# Altium schematic sheet Moto_Driver.SchDoc
size A3
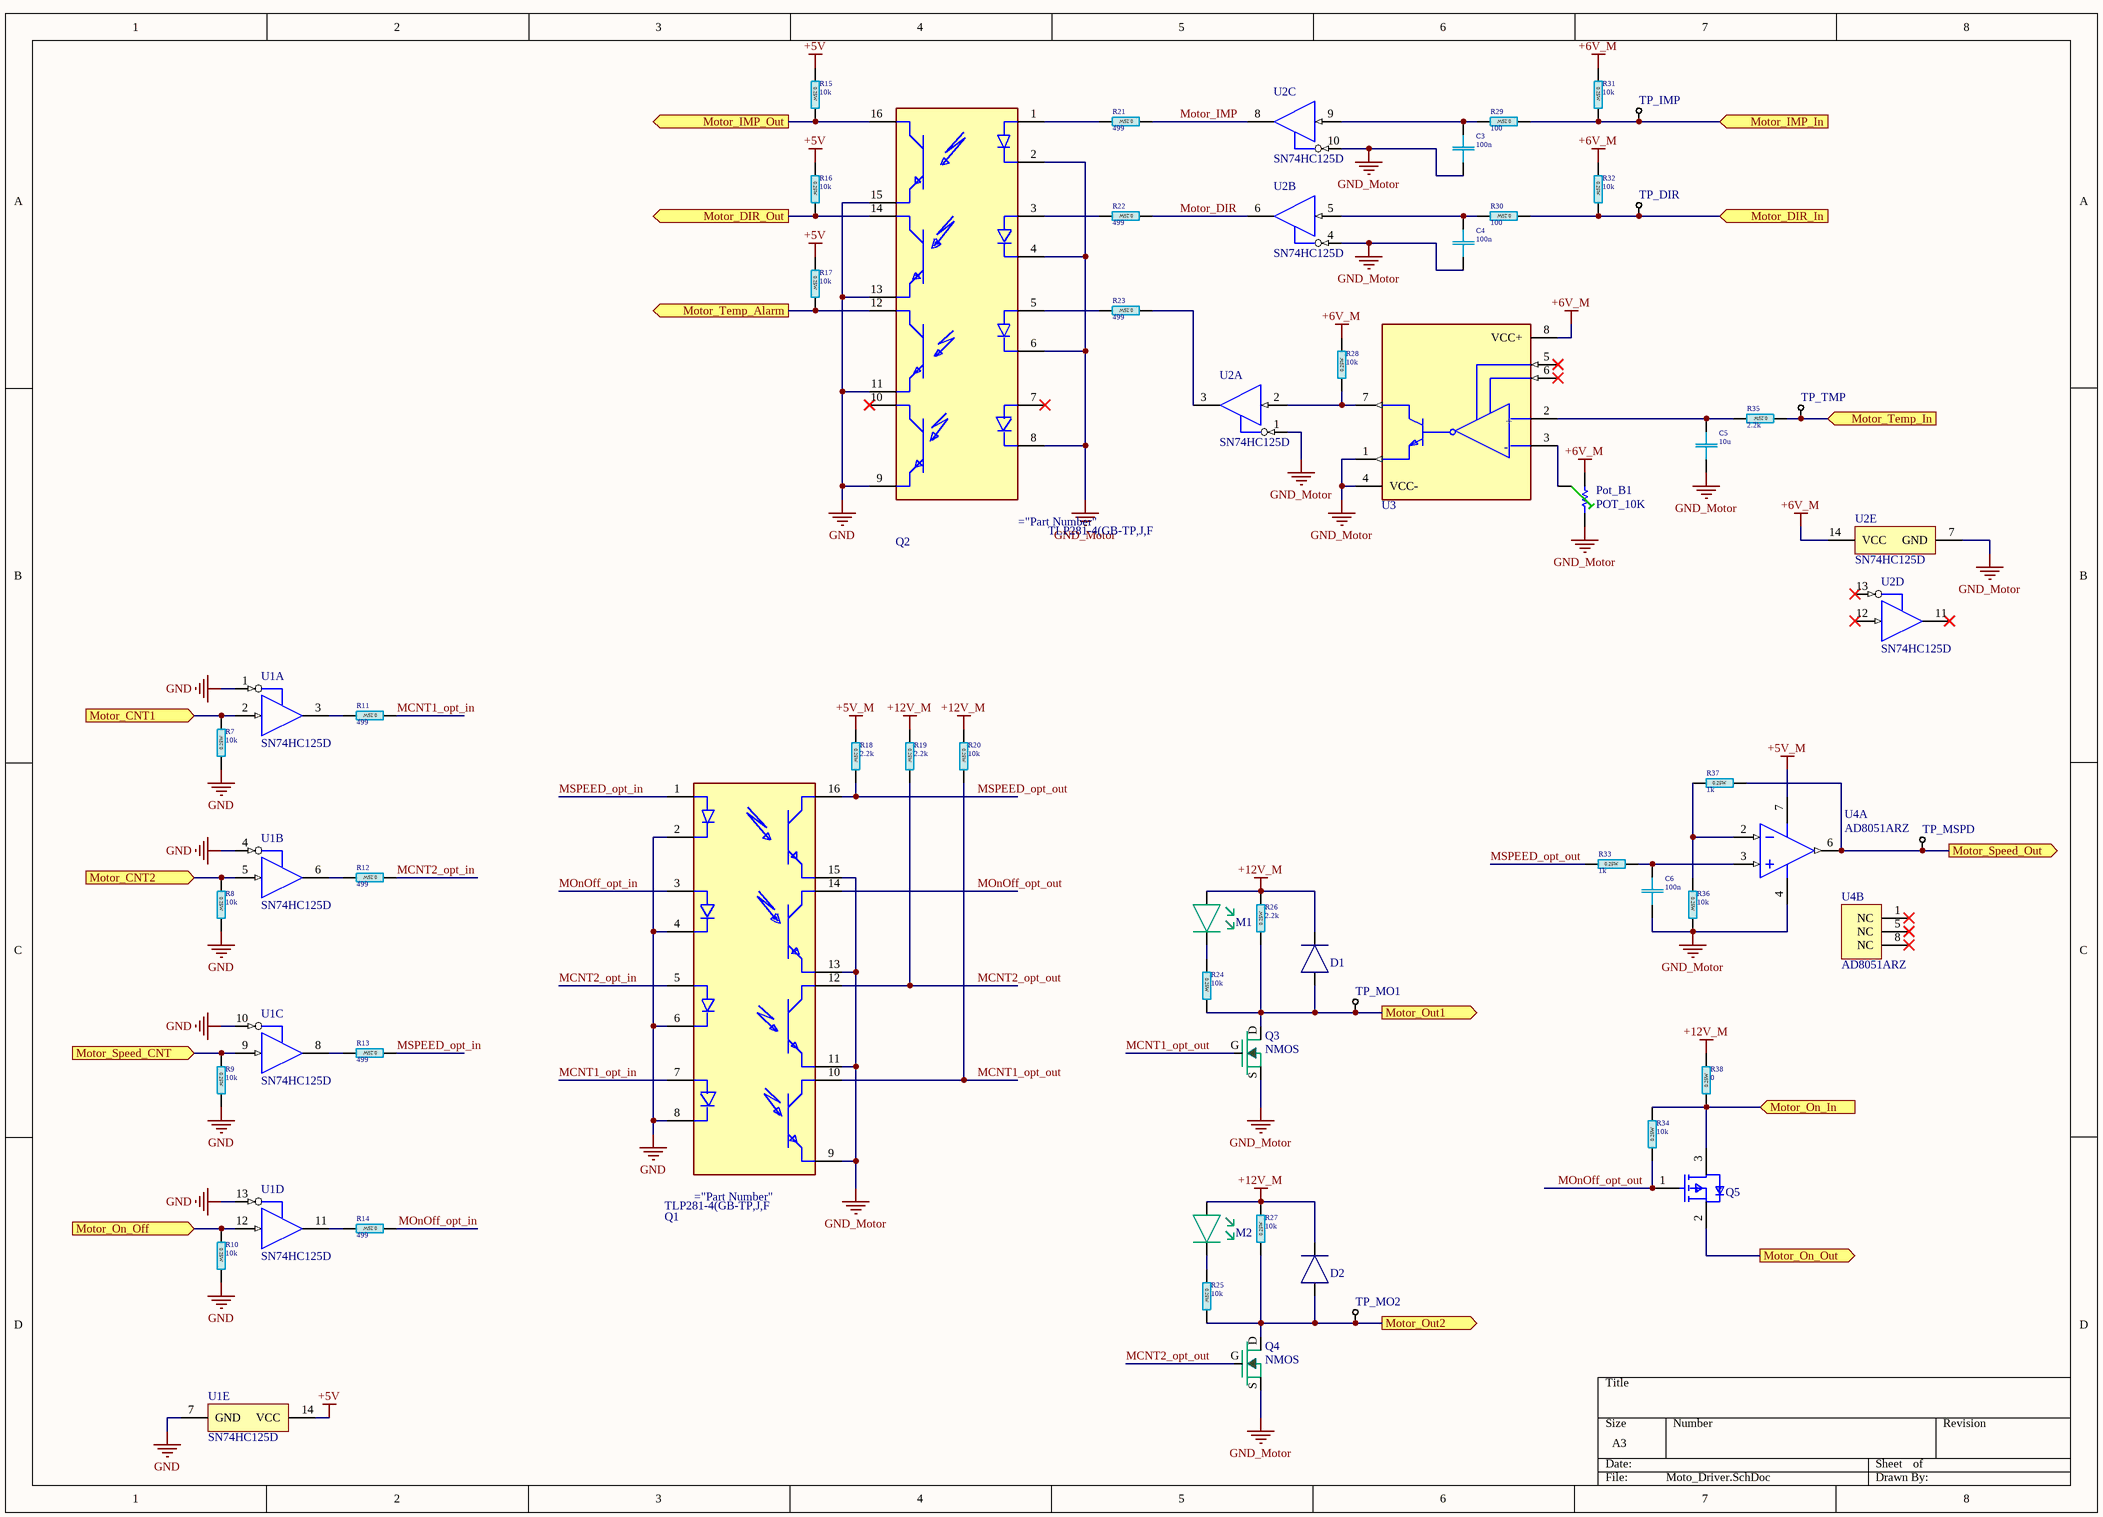
[diagram p0: Moto_Driver.SchDoc]

## Parts
C3  100n  [C1206]
C4  100n  [C1206]
C5  10u  [C1206]
C6  100n  [C1206]
D1  Diode  [Diode-M7]  (value not drawn)
D2  Diode  [Diode-M7]  (value not drawn)
M1  LED  [LED 1206]  (value not drawn)
M2  LED  [LED 1206]  (value not drawn)
Pot_B1  POT_10K  [3296W]
Q1  TLP281-4_GB-TP,J,F  [Toshiba_11-10F1_0]  (value not drawn)
Q2  TLP281-4_GB-TP,J,F  [Toshiba_11-10F1_0]  (value not drawn)
Q3  NMOS  [NMOS SOT-23]
Q4  NMOS  [NMOS SOT-23]
Q5  FDN360P  [ON_Semiconductor_527AG-01_IPC_A]  (value not drawn)
R7  10k  [R1206]
R8  10k  [R1206]
R9  10k  [R1206]
R10  10k  [R1206]
R11  499  [R1206]
R12  499  [R1206]
R13  499  [R1206]
R14  499  [R1206]
R15  10k  [R1206]
R16  10k  [R1206]
R17  10k  [R1206]
R18  2.2k  [R1206]
R19  2.2k  [R1206]
R20  10k  [R1206]
R21  499  [R1206]
R22  499  [R1206]
R23  499  [R1206]
R24  10k  [R1206]
R25  10k  [R1206]
R26  2.2k  [R1206]
R27  10k  [R1206]
R28  10k  [R1206]
R29  100  [R1206]
R30  100  [R1206]
R31  10k  [R1206]
R32  10k  [R1206]
R33  1k  [R1206]
R34  10k  [R1206]
R35  2.2k  [R1206]
R36  10k  [R1206]
R37  1k  [R1206]
R38  0  [R1206]
TP_DIR  Test Point  [Test Point Small]  (value not drawn)
TP_IMP  Test Point  [Test Point Small]  (value not drawn)
TP_MO1  Test Point  [Test Point Small]  (value not drawn)
TP_MO2  Test Point  [Test Point Small]  (value not drawn)
TP_MSPD  Test Point  [Test Point Small]  (value not drawn)
TP_TMP  Test Point  [Test Point Small]  (value not drawn)
U1  SN74HC125D  [D0014A_M]  (parts A,B,C,D,E of 5)
U2  SN74HC125D  [D0014A_M]  (parts A,B,C,D,E of 5)
U3  LM311D  [Texas_Instruments_D_R-PDSO-G8_0]  (value not drawn)
U4  AD8051ARZ  [ADI-R-8_M]  (parts A,B of 2)

## Ports
Motor_CNT1 (in), Motor_CNT2 (in), Motor_DIR_In (in), Motor_DIR_Out (out), Motor_IMP_In (in), Motor_IMP_Out (out), Motor_On_In (in), Motor_On_Off (in), Motor_On_Out (out), Motor_Out1 (out), Motor_Out2 (out), Motor_Speed_CNT (in), Motor_Speed_Out (out), Motor_Temp_Alarm (out), Motor_Temp_In (in)

## Nets
+5V: R15.1 R16.1 R17.1 U1.14(VCC)
+5V_M: R18.1 U4.7(+VS)
+6V_M: Pot_B1.3(CW) R28.2 R31.1 R32.1 U2.14(VCC) U3.8(VCC+)
+12V_M: D1.K D2.K M1.A M2.A R19.1 R20.1 R26.2 R27.2 R38.2
GND: Q1.2(1_CATHODE) Q1.4(2_CATHODE) Q1.6(3_CATHODE) Q1.8(4_CATHODE) Q2.9(E) Q2.11(E) Q2.13(E) Q2.15(E) R7.1 R8.2 R9.2 R10.2 U1.1(1~{OE}) U1.4(2~{OE}) U1.7(GND) U1.10(3~{OE}) U1.13(4~{OE})
GND_Motor: C3.2 C4.2 C5.2 C6.2 Pot_B1.1(CCW) Q1.9(E) Q1.11(E) Q1.13(E) Q1.15(E) Q2.2(1_CATHODE) Q2.4(2_CATHODE) Q2.6(3_CATHODE) Q2.8(4_CATHODE) Q3.S Q4.S R36.2 U2.1(1~{OE}) U2.4(2~{OE}) U2.7(GND) U2.10(3~{OE}) U3.1(EMIT_OUT) U3.4(VCC-) U4.4(-VS)
MCNT1_opt_in: Q1.7(4_ANODE) R11.1
MCNT1_opt_out: Q1.10(C) Q3.G R20.2
MCNT2_opt_in: Q1.5(3_ANODE) R12.1
MCNT2_opt_out: Q1.12(C) Q4.G R19.2
MOnOff_opt_in: Q1.3(2_ANODE) R14.1
MOnOff_opt_out: Q1.14(C) Q5.1(G) R34.1
Motor_CNT1: R7.2 U1.2(1A) ; port Motor_CNT1
Motor_CNT2: R8.1 U1.5(2A) ; port Motor_CNT2
Motor_DIR: R22.1 U2.6(2Y)
Motor_DIR_In: R30.1 R32.2 TP_DIR.1(T) ; port Motor_DIR_In
Motor_DIR_Out: Q2.14(C) R16.2 ; port Motor_DIR_Out
Motor_IMP: R21.1 U2.8(3Y)
Motor_IMP_In: R29.1 R31.2 TP_IMP.1(T) ; port Motor_IMP_In
Motor_IMP_Out: Q2.16(C) R15.2 ; port Motor_IMP_Out
Motor_On_In: Q5.3(D) R34.2 R38.1 ; port Motor_On_In
Motor_On_Off: R10.1 U1.12(4A) ; port Motor_On_Off
Motor_On_Out: Q5.2(S) ; port Motor_On_Out
Motor_Out1: D1.A Q3.D R24.2 R26.1 TP_MO1.1(T) ; port Motor_Out1
Motor_Out2: D2.A Q4.D R25.2 R27.1 TP_MO2.1(T) ; port Motor_Out2
Motor_Speed_CNT: R9.1 U1.9(3A) ; port Motor_Speed_CNT
Motor_Speed_Out: R37.2 TP_MSPD.1(T) U4.6(VOUT) ; port Motor_Speed_Out
Motor_Temp_Alarm: Q2.12(C) R17.2 ; port Motor_Temp_Alarm
Motor_Temp_In: R35.1 TP_TMP.1(T) ; port Motor_Temp_In
MSPEED_opt_in: Q1.1(1_ANODE) R13.1
MSPEED_opt_out: Q1.16(C) R18.2 R33.1
NetC3_1: C3.1 R29.2 U2.9(3A)
NetC4_1: C4.1 R30.2 U2.5(2A)
NetC5_1: C5.1 R35.2 U3.2(IN+)
NetC6_1: C6.1 R33.2 U4.3(+IN)
NetM1_K: M1.K R24.1
NetM2_K: M2.K R25.1
NetPot_B1_2: Pot_B1.2(WIPER) U3.3(IN-)
NetQ2_1: Q2.1(1_ANODE) R21.2
NetQ2_3: Q2.3(2_ANODE) R22.2
NetQ2_5: Q2.5(3_ANODE) R23.2
NetR11_2: R11.2 U1.3(1Y)
NetR12_2: R12.2 U1.6(2Y)
NetR13_2: R13.2 U1.8(3Y)
NetR14_2: R14.2 U1.11(4Y)
NetR23_1: R23.1 U2.3(1Y)
NetR28_1: R28.1 U2.2(1A) U3.7(COL_OUT)
NetR36_1: R36.1 R37.1 U4.2(-IN)

Not connected (* = marked no-connect by the designer): Q2 7(4_ANODE)* 10(C)*; U2 11(4Y)* 12(4A)* 13(4~{OE})*; U3 5(BALANCE)* 6(BAL/STRB)*; U4 1(NC)* 5(NC)* 8(NC)*

## Notes on the sheet
- (in symbol LM311D) +; -
- (in symbol TLP281-4_GB-TP,J,F) TLP281-4(GB-TP,J,F

## Library data of the parts
C3-C6 = C 1206  100V X7R - 100n: SMD 1206   100V X7R 10%; Part Number: CL31B104KCFNNNE; Manufacturer: Samsung; TYPE: Capacitors; Package-mm: 3216; Mount Type: SMT; Publisher: Hefest; Manufacturer Alternate: *; Part Number Alternate: *; Published: 07.04.2019; Supplier 1: Comet; Supplier Part Number 1: C1206 100nF 100V X7R SAMSUNG; RoHS: Y; Technology: Ceramic  MLCC; Package: 1206; VDC: 100V; TempCo: X7R; Tolerance %: ±10%; VAC: *; ESR Ohm: *; ComponentLink1Description: Datasheet Link; ComponentLink1URL: https://store.comet.bg/download-file.php?id=11; Temperature Range: -55°C ~ +125°C; Price: 0.090; ComponentLink2Description: Characteristics data; ComponentLink2URL: https://store.comet.bg/download-file.php?id=3821
  C3 C4 C6: Value: 100n
  C5: Value: 10u
Pot_B1 = RES_POT_LIN
R7-R38 = R 1206-5%: SMD 1206 0.25W   5% 200V; Manufacturer: YAGEO; TempCo: ±100ppm/°C; Package-mm: 3216; Value Code: 102; Part Number: *; Mount Type: SMT; Publisher: Hefest; Manufacturer Alternate: *; Published: 07.04.2019; Supplier 1: Comet; Supplier Part Number 1: R1206 1.0K 5% YAG/ASJ; RoHS: Y; Technology: Thick film; Package: 1206; VDC: 200V; Tolerance %: ±5%; ComponentLink1Description: Datasheet Link; ComponentLink1URL: https://store.comet.bg/download-file.php?id=140; Temperature Range: -55°C ~ +155°C; Price: 0.054; Part Number Alternate: *; TYPE: Resistor; Power: 0.25W
  R7-R10 R15-R17 R20 R24 R25 R27 R28 R31 R32 R34 R36: Value: 10k
  R11-R14 R21-R23: Value: 499
  R18 R19 R26 R35: Value: 2.2k
  R29 R30: Value: 100
  R33 R37: Value: 1k
  R38: Value: 0
U1 U2 = SN74HC125D: Quadruple Bus Buffer Gates With 3-State Outputs, D0014A, TUBE; tpd @ Nom Voltage(Max)(ns): 26; Input Type: CMOS; Voltage(Nom)(V): 6; Bits(#): 4; VCC(Min)(V): 2; F @ Nom Voltage(Max)(Mhz): 28; Rating: Catalog; ICC @ Nom Voltage(Max)(mA): 0.16; ComponentLink1Description: Manufacturer URL; ComponentLink2Description: Datasheet; Part Number: SN74HC125; DatasheetVersion: SCLS104D; ComponentLink1URL: http://www.ti.com/; Output Type: CMOS; ComponentLink2URL: http://www.ti.com/lit/ds/symlink/sn74hc125.pdf; Operating Temperature Range(C): -40 to 85; Code_IPC: MS-012; VCC(Max)(V): 6; PartNumber: SN74HC125D; PackageVersion: http://www.ti.com/lit/ml/mpds177g/mpds177g.pdf; PackageReference: D0014A
U4 = AD8051ARZ: Single Channel Single-Supply Operation Operational Amplifier, 110 MHz BW, 170 V/us SR, Industrial, 8-pin SOIC (R-8), Tube; Generic Part Number: AD8051; Manufacturer: Analog Devices; Amplifiers Per Package: 1; Small Signal Bandwidth: 110MHz; V Span Min: 3V; Iq/Amp: 5.5mA; Input Bias Current: 1.4uA; V Span Max: 12V; Input Offset Voltage: 1.7mV; PartNumber: AD8051ARZ; PackageVersion: 060506-A; ComponentLink1Description: Manufacturer URL; ComponentLink2Description: Datasheet; DatasheetVersion: Rev. J; ComponentLink3URL: http://www.analog.com/static/imported-files/packages/PKG_PDF/SOIC_Narrow%20(R)/R_8.pdf; ComponentLink1URL: http://www.analog.com/en/index.html; Code_JEDEC: MS-012-AA; Packing: Tube; ComponentLink2URL: http://www.analog.com/static/imported-files/data_sheets/AD8051_8052_8054.pdf; PackageReference: R-8; ComponentLink3Description: Package Specification; Slew Rate: 170V/us; Mounting Technology: Surface Mount; PackageDescription: 8-Pin Standard Small Outline Package, Body 3.9 x 4.9 mm, Pitch 1.27 mm